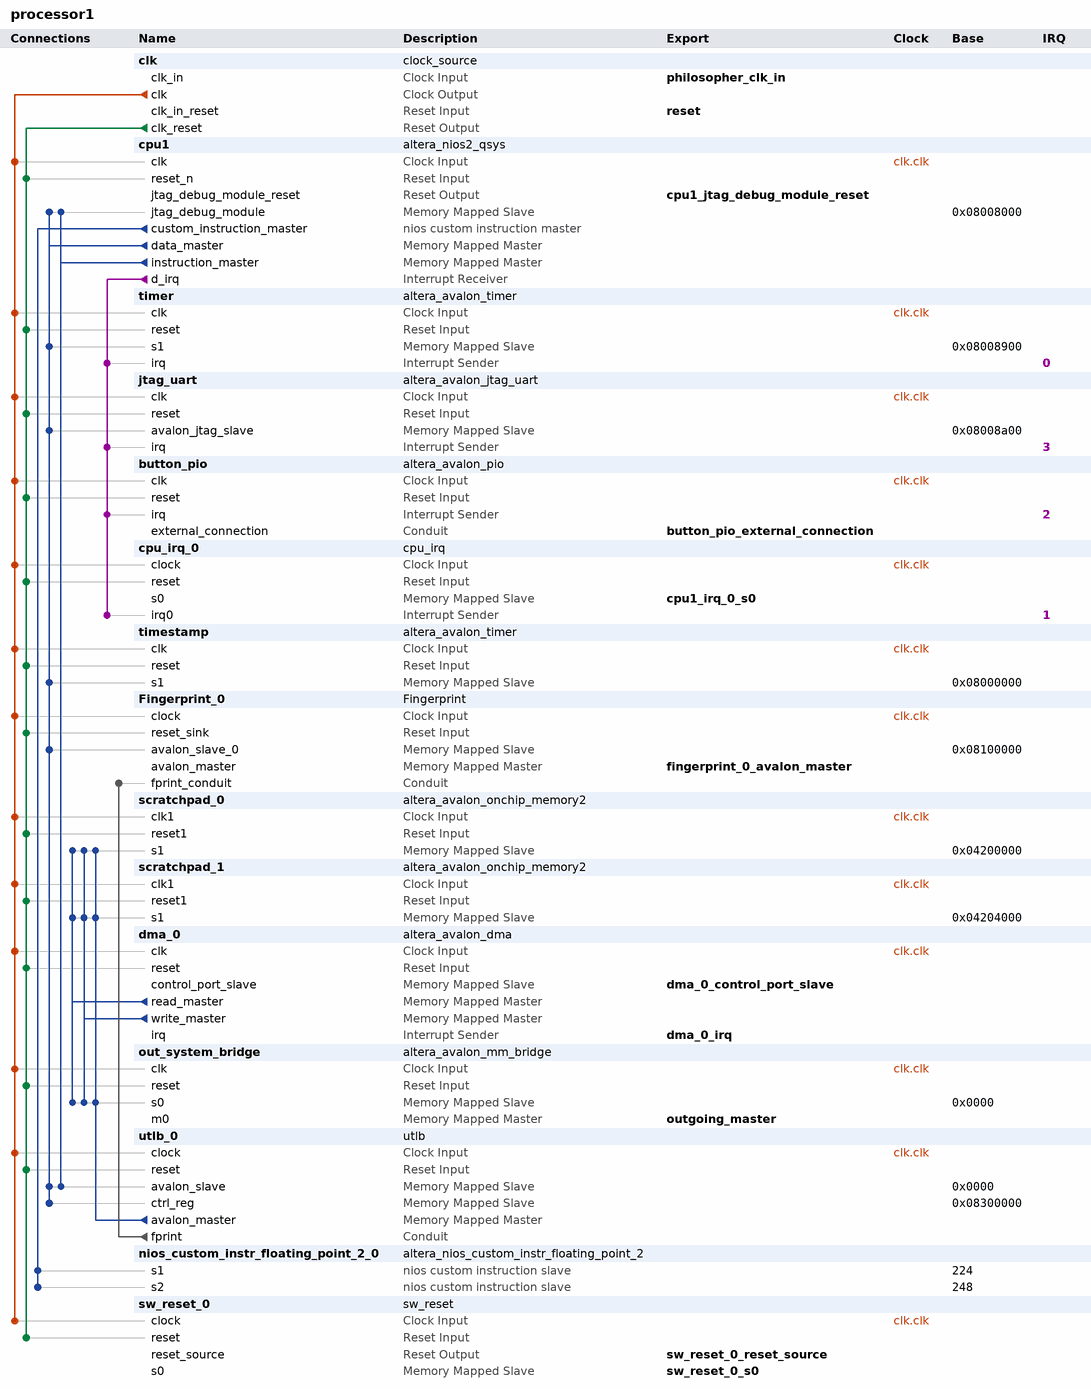
[diagram p0: system contents]
# Platform Designer (Qsys) system processor1, Arria V 5AGXFB3H4F35C5
# Parameters at their usual value, and those the tool derives, are not listed.
package require -exact qsys 13.1
create_system processor1
set_project_property DEVICE_FAMILY {Arria V}
set_project_property DEVICE 5AGXFB3H4F35C5

add_instance clk clock_source 13.1
set_instance_parameter_value clk clockFrequency 50000000

add_instance cpu1 altera_nios2_qsys 13.1
set_instance_parameter_value cpu1 muldiv_divider true
set_instance_parameter_value cpu1 mpu_useLimit true
set_instance_parameter_value cpu1 mpu_enabled true
set_instance_parameter_value cpu1 mpu_numOfDataRegion 16
set_instance_parameter_value cpu1 resetOffset 4399104
set_instance_parameter_value cpu1 exceptionOffset 4399136
set_instance_parameter_value cpu1 cpuID 2
set_instance_parameter_value cpu1 resetSlave Absolute
set_instance_parameter_value cpu1 exceptionSlave Absolute
set_instance_parameter_value cpu1 breakSlave cpu1.jtag_debug_module
set_instance_parameter_value cpu1 muldiv_multiplierType DSPBlock
set_instance_parameter_value cpu1 mpu_minInstRegionSize 6
set_instance_parameter_value cpu1 mpu_minDataRegionSize 6
set_instance_parameter_value cpu1 impl Fast
set_instance_parameter_value cpu1 icache_size 1024
set_instance_parameter_value cpu1 dcache_size 0

add_instance timer altera_avalon_timer 13.1
set_instance_parameter_value timer period 10
set_instance_parameter_value timer periodUnits MSEC

add_instance jtag_uart altera_avalon_jtag_uart 13.1
set_instance_parameter_value jtag_uart simInteractiveOptions INTERACTIVE_ASCII_OUTPUT

add_instance button_pio altera_avalon_pio 13.1
set_instance_parameter_value button_pio bitClearingEdgeCapReg true
set_instance_parameter_value button_pio captureEdge true
set_instance_parameter_value button_pio direction Input
set_instance_parameter_value button_pio generateIRQ true
set_instance_parameter_value button_pio irqType EDGE
set_instance_parameter_value button_pio width 1

add_instance cpu_irq_0 cpu_irq 1.0

add_instance timestamp altera_avalon_timer 13.1
set_instance_parameter_value timestamp counterSize 64
set_instance_parameter_value timestamp period 1
set_instance_parameter_value timestamp periodUnits MSEC

add_instance Fingerprint_0 Fingerprint 1.0
set_instance_parameter_value Fingerprint_0 CORE_ID 1

add_instance scratchpad_0 altera_avalon_onchip_memory2 13.1
set_instance_parameter_value scratchpad_0 dataWidth 32
set_instance_parameter_value scratchpad_0 dualPort false
set_instance_parameter_value scratchpad_0 initMemContent true
set_instance_parameter_value scratchpad_0 initializationFileName onchip_mem.hex
set_instance_parameter_value scratchpad_0 memorySize 16384

add_instance scratchpad_1 altera_avalon_onchip_memory2 13.1
set_instance_parameter_value scratchpad_1 dataWidth 32
set_instance_parameter_value scratchpad_1 dualPort false
set_instance_parameter_value scratchpad_1 initMemContent true
set_instance_parameter_value scratchpad_1 initializationFileName onchip_mem.hex
set_instance_parameter_value scratchpad_1 memorySize 16384

add_instance dma_0 altera_avalon_dma 13.1
set_instance_parameter_value dma_0 allowByteTransactions true
set_instance_parameter_value dma_0 allowDoubleWordTransactions true
set_instance_parameter_value dma_0 allowHalfWordTransactions true
set_instance_parameter_value dma_0 allowQuadWordTransactions true
set_instance_parameter_value dma_0 burstEnable false
set_instance_parameter_value dma_0 fifoDepth 32
set_instance_parameter_value dma_0 maxBurstSize 128
set_instance_parameter_value dma_0 minimumDmaTransactionRegisterWidth 13

add_instance out_system_bridge altera_avalon_mm_bridge 13.1
set_instance_parameter_value out_system_bridge DATA_WIDTH 32
set_instance_parameter_value out_system_bridge ADDRESS_WIDTH 26
set_instance_parameter_value out_system_bridge ADDRESS_UNITS SYMBOLS
set_instance_parameter_value out_system_bridge MAX_PENDING_RESPONSES 4

add_instance utlb_0 utlb 4.2
set_instance_parameter_value utlb_0 tagwidth 15
set_instance_parameter_value utlb_0 addresswidth 27
set_instance_parameter_value utlb_0 numentries 4
set_instance_parameter_value utlb_0 datawidth 32
set_instance_parameter_value utlb_0 byteenablewidth 4

add_instance nios_custom_instr_floating_point_2_0 altera_nios_custom_instr_floating_point_2 100.99.98.97

add_instance sw_reset_0 sw_reset 1.0

# connections
add_connection clk.clk button_pio.clk clock
add_connection clk.clk cpu1.clk clock
add_connection clk.clk cpu_irq_0.clock clock
add_connection clk.clk dma_0.clk clock
add_connection clk.clk Fingerprint_0.clock clock
add_connection clk.clk jtag_uart.clk clock
add_connection clk.clk out_system_bridge.clk clock
add_connection clk.clk scratchpad_0.clk1 clock
add_connection clk.clk scratchpad_1.clk1 clock
add_connection clk.clk sw_reset_0.clock clock
add_connection clk.clk timer.clk clock
add_connection clk.clk timestamp.clk clock
add_connection clk.clk utlb_0.clock clock
add_connection clk.clk_reset button_pio.reset reset
add_connection clk.clk_reset cpu1.reset_n reset
add_connection clk.clk_reset cpu_irq_0.reset reset
add_connection clk.clk_reset dma_0.reset reset
add_connection clk.clk_reset Fingerprint_0.reset_sink reset
add_connection clk.clk_reset jtag_uart.reset reset
add_connection clk.clk_reset out_system_bridge.reset reset
add_connection clk.clk_reset scratchpad_0.reset1 reset
add_connection clk.clk_reset scratchpad_1.reset1 reset
add_connection clk.clk_reset sw_reset_0.reset reset
add_connection clk.clk_reset timer.reset reset
add_connection clk.clk_reset timestamp.reset reset
add_connection clk.clk_reset utlb_0.reset reset
add_connection cpu1.data_master cpu1.jtag_debug_module avalon
set_connection_parameter_value cpu1.data_master/cpu1.jtag_debug_module baseAddress 0x08008000
add_connection cpu1.data_master Fingerprint_0.avalon_slave_0 avalon
set_connection_parameter_value cpu1.data_master/Fingerprint_0.avalon_slave_0 baseAddress 0x08100000
add_connection cpu1.data_master jtag_uart.avalon_jtag_slave avalon
set_connection_parameter_value cpu1.data_master/jtag_uart.avalon_jtag_slave baseAddress 0x08008a00
add_connection cpu1.data_master timer.s1 avalon
set_connection_parameter_value cpu1.data_master/timer.s1 baseAddress 0x08008900
add_connection cpu1.data_master timestamp.s1 avalon
set_connection_parameter_value cpu1.data_master/timestamp.s1 baseAddress 0x08000000
add_connection cpu1.data_master utlb_0.avalon_slave avalon
set_connection_parameter_value cpu1.data_master/utlb_0.avalon_slave baseAddress 0x0000
add_connection cpu1.data_master utlb_0.ctrl_reg avalon
set_connection_parameter_value cpu1.data_master/utlb_0.ctrl_reg baseAddress 0x08300000
add_connection cpu1.instruction_master cpu1.jtag_debug_module avalon
set_connection_parameter_value cpu1.instruction_master/cpu1.jtag_debug_module baseAddress 0x08008000
add_connection cpu1.instruction_master utlb_0.avalon_slave avalon
set_connection_parameter_value cpu1.instruction_master/utlb_0.avalon_slave baseAddress 0x0000
add_connection dma_0.read_master out_system_bridge.s0 avalon
set_connection_parameter_value dma_0.read_master/out_system_bridge.s0 baseAddress 0x0000
add_connection dma_0.read_master scratchpad_0.s1 avalon
set_connection_parameter_value dma_0.read_master/scratchpad_0.s1 baseAddress 0x04200000
add_connection dma_0.read_master scratchpad_1.s1 avalon
set_connection_parameter_value dma_0.read_master/scratchpad_1.s1 baseAddress 0x04204000
add_connection dma_0.write_master out_system_bridge.s0 avalon
set_connection_parameter_value dma_0.write_master/out_system_bridge.s0 baseAddress 0x0000
add_connection dma_0.write_master scratchpad_0.s1 avalon
set_connection_parameter_value dma_0.write_master/scratchpad_0.s1 baseAddress 0x04200000
add_connection dma_0.write_master scratchpad_1.s1 avalon
set_connection_parameter_value dma_0.write_master/scratchpad_1.s1 baseAddress 0x04204000
add_connection utlb_0.avalon_master out_system_bridge.s0 avalon
set_connection_parameter_value utlb_0.avalon_master/out_system_bridge.s0 baseAddress 0x0000
add_connection utlb_0.avalon_master scratchpad_0.s1 avalon
set_connection_parameter_value utlb_0.avalon_master/scratchpad_0.s1 baseAddress 0x04200000
add_connection utlb_0.avalon_master scratchpad_1.s1 avalon
set_connection_parameter_value utlb_0.avalon_master/scratchpad_1.s1 baseAddress 0x04204000
add_connection utlb_0.fprint Fingerprint_0.fprint_conduit conduit
add_connection cpu1.d_irq button_pio.irq interrupt
set_connection_parameter_value cpu1.d_irq/button_pio.irq irqNumber 2
add_connection cpu1.d_irq cpu_irq_0.irq0 interrupt
set_connection_parameter_value cpu1.d_irq/cpu_irq_0.irq0 irqNumber 1
add_connection cpu1.d_irq jtag_uart.irq interrupt
set_connection_parameter_value cpu1.d_irq/jtag_uart.irq irqNumber 3
add_connection cpu1.d_irq timer.irq interrupt
set_connection_parameter_value cpu1.d_irq/timer.irq irqNumber 0
add_connection cpu1.custom_instruction_master nios_custom_instr_floating_point_2_0.s1 nios_custom_instruction
set_connection_parameter_value cpu1.custom_instruction_master/nios_custom_instr_floating_point_2_0.s1 CIName nios_custom_instr_floating_point_2_0
set_connection_parameter_value cpu1.custom_instruction_master/nios_custom_instr_floating_point_2_0.s1 baseAddress 224
add_connection cpu1.custom_instruction_master nios_custom_instr_floating_point_2_0.s2 nios_custom_instruction
set_connection_parameter_value cpu1.custom_instruction_master/nios_custom_instr_floating_point_2_0.s2 CIName nios_custom_instr_floating_point_2_0_1
set_connection_parameter_value cpu1.custom_instruction_master/nios_custom_instr_floating_point_2_0.s2 baseAddress 248

# exported interfaces
add_interface philosopher_clk_in clock sink
set_interface_property philosopher_clk_in EXPORT_OF clk.clk_in
add_interface outgoing_master avalon master
set_interface_property outgoing_master EXPORT_OF out_system_bridge.m0
add_interface button_pio_external_connection conduit end
set_interface_property button_pio_external_connection EXPORT_OF button_pio.external_connection
add_interface reset reset sink
set_interface_property reset EXPORT_OF clk.clk_in_reset
add_interface cpu1_jtag_debug_module_reset reset source
set_interface_property cpu1_jtag_debug_module_reset EXPORT_OF cpu1.jtag_debug_module_reset
add_interface cpu1_irq_0_s0 avalon slave
set_interface_property cpu1_irq_0_s0 EXPORT_OF cpu_irq_0.s0
add_interface dma_0_irq interrupt sender
set_interface_property dma_0_irq EXPORT_OF dma_0.irq
add_interface fingerprint_0_avalon_master avalon master
set_interface_property fingerprint_0_avalon_master EXPORT_OF Fingerprint_0.avalon_master
add_interface dma_0_control_port_slave avalon slave
set_interface_property dma_0_control_port_slave EXPORT_OF dma_0.control_port_slave
add_interface sw_reset_0_s0 avalon slave
set_interface_property sw_reset_0_s0 EXPORT_OF sw_reset_0.s0
add_interface sw_reset_0_reset_source reset source
set_interface_property sw_reset_0_reset_source EXPORT_OF sw_reset_0.reset_source

set_interconnect_requirement {$system} qsys_mm.clockCrossingAdapter HANDSHAKE
set_interconnect_requirement {$system} qsys_mm.maxAdditionalLatency 1

save_system processor1.qsys
